# Altium schematic sheet BMS AFE - Top Sheet.SchDoc
size B
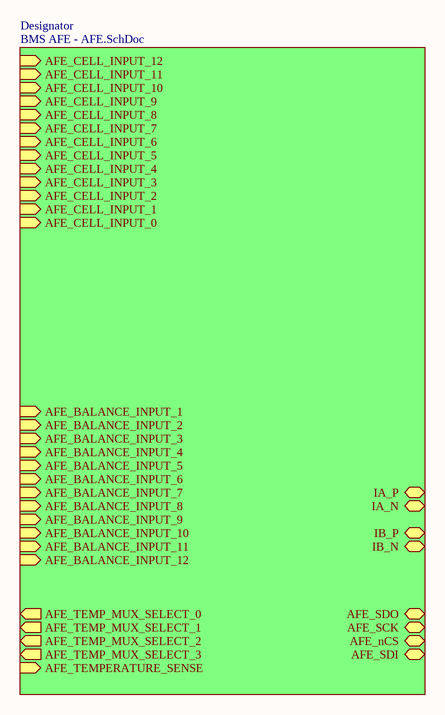
[diagram p0: BMS AFE - Top Sheet.SchDoc]

## Sub-sheets
Designator = BMS AFE - AFE.SchDoc: AFE_CELL_INPUT_11 (in), AFE_CELL_INPUT_3 (in), AFE_BALANCE_INPUT_1 (in), AFE_CELL_INPUT_0 (in), AFE_CELL_INPUT_4 (in), IA_N (bidir), AFE_CELL_INPUT_5 (in), AFE_BALANCE_INPUT_2 (in), AFE_CELL_INPUT_12 (in), AFE_SDI (bidir), AFE_BALANCE_INPUT_5 (in), AFE_TEMP_MUX_SELECT_1 (out), AFE_TEMP_MUX_SELECT_3 (out), AFE_BALANCE_INPUT_7 (in), AFE_CELL_INPUT_6 (in), AFE_BALANCE_INPUT_6 (in), AFE_CELL_INPUT_1 (in), AFE_SDO (bidir), AFE_TEMP_MUX_SELECT_0 (out), AFE_CELL_INPUT_2 (in), AFE_CELL_INPUT_10 (in), AFE_SCK (bidir), IA_P (bidir), AFE_CELL_INPUT_8 (in), IB_P, IB_N (bidir), AFE_CELL_INPUT_7 (in), AFE_BALANCE_INPUT_3 (in), AFE_BALANCE_INPUT_4 (in), AFE_TEMP_MUX_SELECT_2 (out), AFE_TEMPERATURE_SENSE (in), AFE_nCS (bidir), AFE_CELL_INPUT_9 (in), AFE_BALANCE_INPUT_8 (in), AFE_BALANCE_INPUT_9 (in), AFE_BALANCE_INPUT_10 (in), AFE_BALANCE_INPUT_11 (in), AFE_BALANCE_INPUT_12 (in)